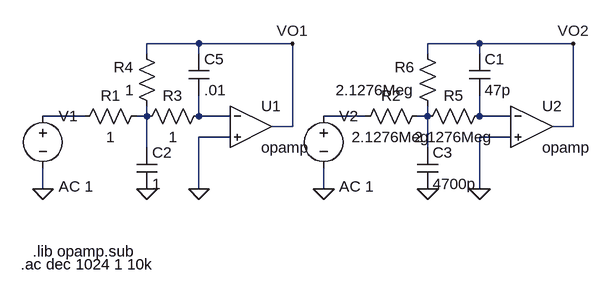
[diagram p0: schematic circuito.asc]
circuito.asc, the LTspice schematic file:
Version 4
SHEET 1 880 680
WIRE 80 16 0 16
WIRE 224 16 80 16
WIRE 512 16 432 16
WIRE 656 16 512 16
WIRE 0 32 0 16
WIRE 80 32 80 16
WIRE 432 32 432 16
WIRE 512 32 512 16
WIRE -96 128 -160 128
WIRE 0 128 0 112
WIRE 0 128 -16 128
WIRE 80 128 80 96
WIRE 128 128 80 128
WIRE 336 128 272 128
WIRE 432 128 432 112
WIRE 432 128 416 128
WIRE 512 128 512 96
WIRE 560 128 512 128
WIRE 224 144 224 16
WIRE 224 144 192 144
WIRE 656 144 656 16
WIRE 656 144 624 144
WIRE 128 160 80 160
WIRE 560 160 512 160
WIRE 0 176 0 128
WIRE 432 176 432 128
WIRE -160 240 -160 208
WIRE 80 240 80 160
WIRE 272 240 272 208
WIRE 512 240 512 160
FLAG 0 240 0
FLAG -160 240 0
FLAG 432 240 0
FLAG 272 240 0
FLAG 80 240 0
FLAG 512 240 0
FLAG 224 16 VO1
FLAG 656 16 VO2
SYMBOL OpAmps\\opamp 160 80 R0
SYMATTR InstName U1
SYMBOL cap 64 32 R0
SYMATTR InstName C5
SYMATTR Value .01
SYMBOL res 0 112 R90
WINDOW 0 0 56 VBottom 2
WINDOW 3 32 56 VTop 2
SYMATTR InstName R1
SYMATTR Value 1
SYMBOL res 96 112 R90
WINDOW 0 0 56 VBottom 2
WINDOW 3 32 56 VTop 2
SYMATTR InstName R3
SYMATTR Value 1
SYMBOL res 16 128 R180
WINDOW 0 36 76 Left 2
WINDOW 3 36 40 Left 2
SYMATTR InstName R4
SYMATTR Value 1
SYMBOL cap -16 176 R0
SYMATTR InstName C2
SYMATTR Value 1
SYMBOL voltage -160 112 R0
WINDOW 123 24 124 Left 2
WINDOW 39 0 0 Left 0
SYMATTR InstName V1
SYMATTR Value ""
SYMATTR Value2 AC 1
SYMBOL OpAmps\\opamp 592 80 R0
SYMATTR InstName U2
SYMBOL cap 496 32 R0
SYMATTR InstName C1
SYMATTR Value 47p
SYMBOL res 432 112 R90
WINDOW 0 0 56 VBottom 2
WINDOW 3 32 56 VTop 2
SYMATTR InstName R2
SYMATTR Value 2.1276Meg
SYMBOL res 528 112 R90
WINDOW 0 0 56 VBottom 2
WINDOW 3 32 56 VTop 2
SYMATTR InstName R5
SYMATTR Value 2.1276Meg
SYMBOL res 448 128 R180
WINDOW 0 36 76 Left 2
WINDOW 3 36 40 Left 2
SYMATTR InstName R6
SYMATTR Value 2.1276Meg
SYMBOL cap 416 176 R0
SYMATTR InstName C3
SYMATTR Value 4700p
SYMBOL voltage 272 112 R0
WINDOW 123 24 124 Left 2
WINDOW 39 0 0 Left 0
SYMATTR InstName V2
SYMATTR Value ""
SYMATTR Value2 AC 1
TEXT -176 336 Left 2 !.lib opamp.sub
TEXT -194 356 Left 2 !.ac dec 1024 1 10k

The netlist it stands for:
* circuito.asc
XU1 N003 0 VO1 opamp Aol=100K GBW=10Meg  ; pins invin noninvin out
C5 VO1 N003 .01
R1 N002 N001 1
R3 N003 N002 1
R4 N002 VO1 1
C2 N002 0 1
V1 N001 0 AC 1
XU2 N006 0 VO2 opamp Aol=100K GBW=10Meg  ; pins invin noninvin out
C1 VO2 N006 47p
R2 N005 N004 2.1276Meg
R5 N006 N005 2.1276Meg
R6 N005 VO2 2.1276Meg
C3 N005 0 4700p
V2 N004 0 AC 1
.lib opamp.sub
.ac dec 1024 1 10k
.backanno
.end